# EAGLE design DualMotorCape-v7 (EAGLE 6.6.0)
DATABASE: H:\EXADLER\Libraries\Eagle\bom-ex.txt
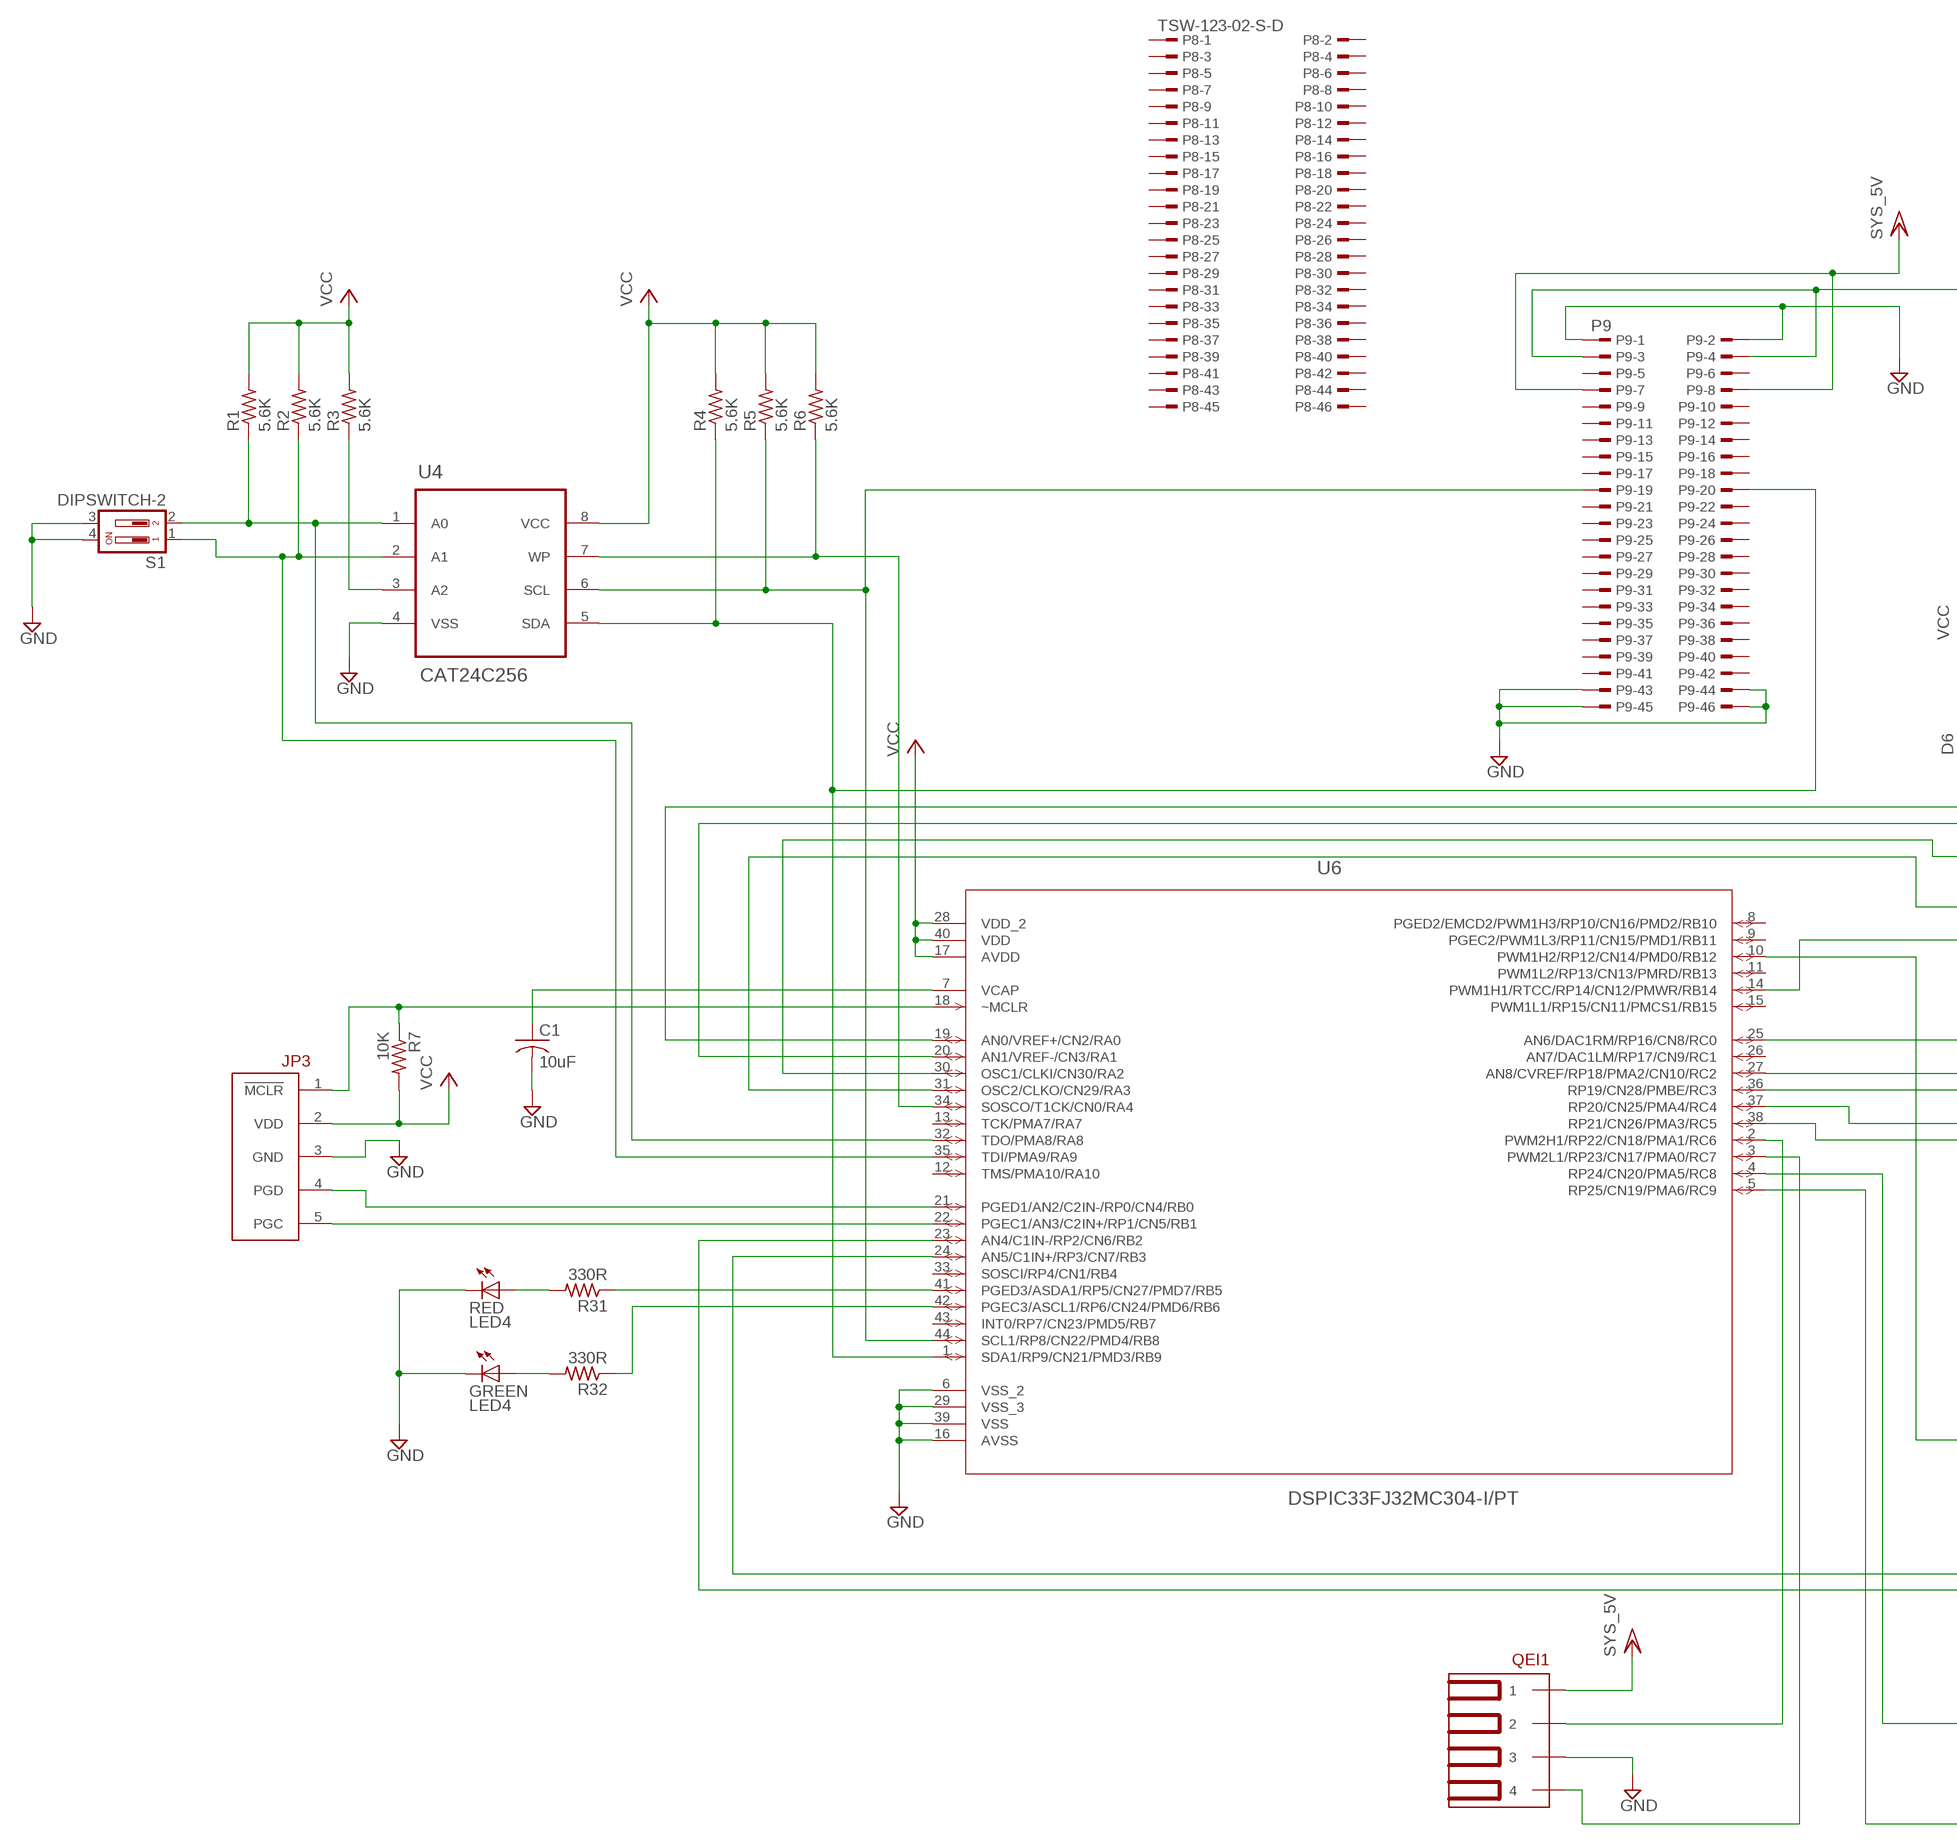
[diagram p0: schematic, sheet 1, part 1 of 2]
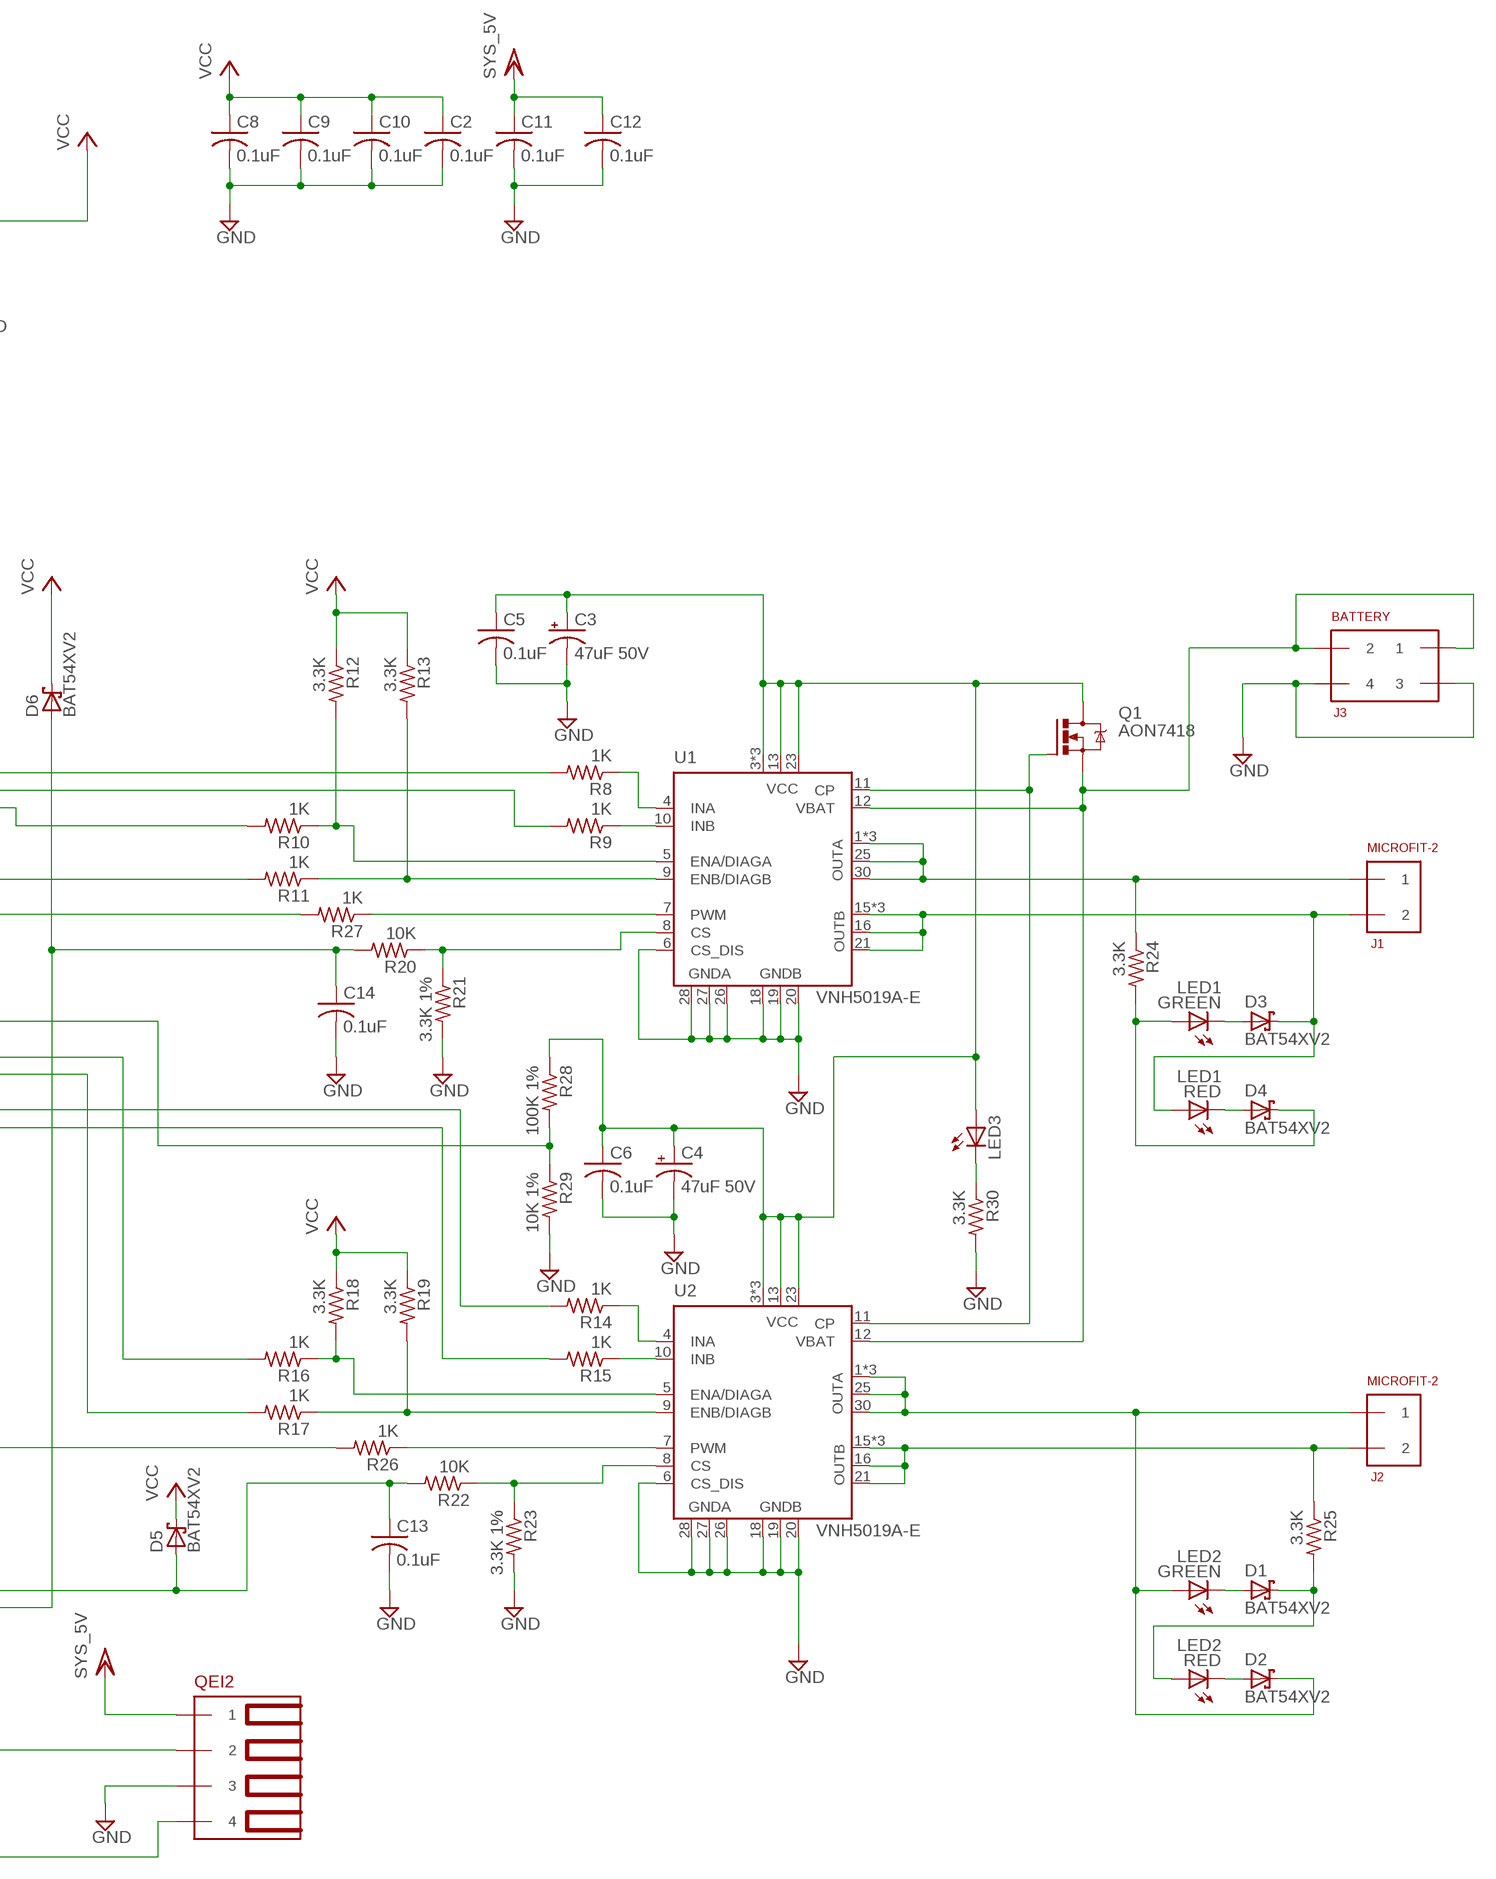
[diagram p1: schematic, sheet 1, part 2 of 2]

## Parts
C1  10uF  C-USC0805  [C0805]
C2  0.1uF  C-USC0603  [C0603]
C3  47uF 50V  CPOL-USUD-8X10  [UD-8X10_NICHICON]
C4  47uF 50V  CPOL-USUD-8X10  [UD-8X10_NICHICON]
C5  0.1uF  C-USC0603  [C0603]
C6  0.1uF  C-USC0603  [C0603]
C8  0.1uF  C-USC0603  [C0603]
C9  0.1uF  C-USC0603  [C0603]
C10  0.1uF  C-USC0603  [C0603]
C11  0.1uF  C-USC0603  [C0603]
C12  0.1uF  C-USC0603  [C0603]
C13  0.1uF  C-USC0603  [C0603]
C14  0.1uF  C-USC0603  [C0603]
D1  BAT54XV2  [SOD523]
D2  BAT54XV2  [SOD523]
D3  BAT54XV2  [SOD523]
D4  BAT54XV2  [SOD523]
D5  BAT54XV2  [SOD523]
D6  BAT54XV2  [SOD523]
J1  MICROFIT-2  [MICROFIT-2-R-TH]
J2  MICROFIT-2  [MICROFIT-2-R-TH]
J3  BATTERY  MICROFIT-4  [MICROFIT-4-R-TH]
JP3  ICD2/3-HEADER  [ICD2/3-HEADER]
LED1  KINGBRIGHT-BI-COLOR-LED  [LED-1.6X1.5MM-BI-COLOR]
LED2  KINGBRIGHT-BI-COLOR-LED  [LED-1.6X1.5MM-BI-COLOR]
LED3  LED-LNJP12X8ARA  [LED-603-PANASONIC]
LED4  KINGBRIGHT-BI-COLOR-LED  [LED-1.6X1.5MM-BI-COLOR]
P8  TSW-123-02-S-D  [TSW-123-02-S-D]
P9  P9  TSW-123-02-S-D  [TSW-123-02-S-D]
Q1  AON7418  MOSFET-N  [DFN3.3X3.3]
QEI1  MOLEX-KK-22-15-2046-4PIN  [MOLEX-KK-22-15-2046-4PIN]
QEI2  MOLEX-KK-22-15-2046-4PIN  [MOLEX-KK-22-15-2046-4PIN]
R1  5.6K  R-US_R0603  [R0603]
R2  5.6K  R-US_R0603  [R0603]
R3  5.6K  R-US_R0603  [R0603]
R4  5.6K  R-US_R0603  [R0603]
R5  5.6K  R-US_R0603  [R0603]
R6  5.6K  R-US_R0603  [R0603]
R7  10K  R-US_R0603  [R0603]
R8  1K  R-US_R0603  [R0603]
R9  1K  R-US_R0603  [R0603]
R10  1K  R-US_R0603  [R0603]
R11  1K  R-US_R0603  [R0603]
R12  3.3K  R-US_R0603  [R0603]
R13  3.3K  R-US_R0603  [R0603]
R14  1K  R-US_R0603  [R0603]
R15  1K  R-US_R0603  [R0603]
R16  1K  R-US_R0603  [R0603]
R17  1K  R-US_R0603  [R0603]
R18  3.3K  R-US_R0603  [R0603]
R19  3.3K  R-US_R0603  [R0603]
R20  10K  R-US_R0603  [R0603]
R21  3.3K 1%  R-US_R0603  [R0603]
R22  10K  R-US_R0603  [R0603]
R23  3.3K 1%  R-US_R0603  [R0603]
R24  3.3K  R-US_R0603  [R0603]
R25  3.3K  R-US_R0603  [R0603]
R26  1K  R-US_R0603  [R0603]
R27  1K  R-US_R0603  [R0603]
R28  100K 1%  R-US_R0603  [R0603]
R29  10K 1%  R-US_R0603  [R0603]
R30  3.3K  R-US_R0603  [R0603]
R31  330R  R-US_R0603  [R0603]
R32  330R  R-US_R0603  [R0603]
S1  DIPSWITCH-2  [DIPSWITCH-218-2]
U1  VNH5019A-E  [VNH5019A-E]
U2  VNH5019A-E  [VNH5019A-E]
U4  CAT24C256  [SOIC-8]
U6  DSPIC33FJ32MC304-I/PT  [QFP80P1200X1200X120-44N]

## Nets
GND: C1.2 C2.2 C3.- C4.- C5.2 C6.2 C8.2 C9.2 C10.2 C11.2 C12.2 C13.2 C14.2 J3.3 J3.4 JP3.3(GND) LED4.2 LED4.4 P9.1 P9.2 P9.43 P9.44 P9.45 P9.46 QEI1.P$3 QEI2.P$3 R21.2 R23.2 R29.2 R30.2 S1.3 S1.4 U1.6(CS_DIS) U1.18(GNDB) U1.19(GNDB) U1.20(GNDB) U1.26(GNDA) U1.27(GNDA) U1.28(GNDA) U2.6(CS_DIS) U2.18(GNDB) U2.19(GNDB) U2.20(GNDB) U2.26(GNDA) U2.27(GNDA) U2.28(GNDA) U4.4(VSS) U6.6(VSS_2) U6.16(AVSS) U6.29(VSS_3) U6.39(VSS)
M1+: J1.2 R24.1 U1.1(OUTA) U1.25(OUTA) U1.30(OUTA) U1.NC/OUTA(OUTA) U1.NC/OUTA@1(OUTA)
M1-: D3.C J1.1 LED1.1 U1.15(OUTB) U1.16(OUTB) U1.21(OUTB) U1.NC/OUTB(OUTB) U1.NC/OUTB@1(OUTB)
M2+: D2.C J2.2 LED2.3 U2.1(OUTA) U2.25(OUTA) U2.30(OUTA) U2.NC/OUTA(OUTA) U2.NC/OUTA@1(OUTA)
M2-: J2.1 R25.1 U2.15(OUTB) U2.16(OUTB) U2.21(OUTB) U2.NC/OUTB(OUTB) U2.NC/OUTB@1(OUTB)
N$1: D4.C LED1.3 R24.2
N$2: LED3.2(C) R30.1
N$3: LED4.1 R31.2
N$4: Q1.4(G) U1.11(CP) U2.11(CP)
N$5: LED4.3 R32.2
N$6: JP3.1(!MCLR) R7.1 U6.18(~MCLR)
N$8: R31.1 U6.41(PGED3/ASDA1/RP5/CN27/PMD7/RB5)
N$9: D3.A LED1.4
N$10: R3.1 U4.3(A2)
N$11: R6.1 U4.7(WP) U6.34(SOSCO/T1CK/CN0/RA4)
N$12: P9.19 R5.1 U4.6(SCL) U6.44(SCL1/RP8/CN22/PMD4/RB8)
N$13: P9.20 R4.1 U4.5(SDA) U6.1(SDA1/RP9/CN21/PMD3/RB9)
N$14: JP3.5(PGC) U6.22(PGEC1/AN3/C2IN+/RP1/CN5/RB1)
N$15: R32.1 U6.42(PGEC3/ASCL1/RP6/CN24/PMD6/RB6)
N$16: JP3.4(PGD) U6.21(PGED1/AN2/C2IN-/RP0/CN4/RB0)
N$18: R11.1 R13.2 U1.9(ENB/DIAGB)
N$19: R10.1 R12.2 U1.5(ENA/DIAGA)
N$20: R27.2 U6.14(PWM1H1/RTCC/RP14/CN12/PMWR/RB14)
N$21: R8.1 U1.4(INA)
N$22: R9.1 U1.10(INB)
N$23: R15.1 U2.10(INB)
N$24: R14.1 U2.4(INA)
N$27: R17.2 U6.36(RP19/CN28/PMBE/RC3)
N$28: R22.1 R23.1 U2.8(CS)
N$29: R20.1 R21.1 U1.8(CS)
N$32: R10.2 U6.30(OSC1/CLKI/CN30/RA2)
N$33: R11.2 U6.31(OSC2/CLKO/CN29/RA3)
N$35: R14.2 U6.37(RP20/CN25/PMA4/RC4)
N$36: R15.2 U6.38(RP21/CN26/PMA3/RC5)
N$37: R16.2 U6.27(AN8/CVREF/RP18/PMA2/CN10/RC2)
N$39: QEI1.P$2 U6.2(PWM2H1/RP22/CN18/PMA1/RC6)
N$40: QEI1.P$4 U6.3(PWM2L1/RP23/CN17/PMA0/RC7)
N$43: R26.1 U2.7(PWM)
N$44: R28.2 R29.1 U6.25(AN6/DAC1RM/RP16/CN8/RC0)
N$45: D1.A LED2.4
N$46: R27.1 U1.7(PWM)
N$47: C1.1 U6.7(VCAP)
N$49: C3.+ C4.+ C5.1 C6.1 LED3.1(A) Q1.5(D) Q1.6(D) Q1.7(D) Q1.8(D) Q1.9(D) R28.1 U1.3(VCC) U1.13(VCC) U1.23(VCC) U1.NC/VCC(VCC) U1.NC/VCC@1(VCC) U2.3(VCC) U2.13(VCC) U2.23(VCC) U2.NC/VCC(VCC) U2.NC/VCC@1(VCC)
N$50: D4.A LED1.2
N$52: D2.A LED2.2
N$53: D1.C LED2.1 R25.2
PWM1H2: R26.2 U6.10(PWM1H2/RP12/CN14/PMD0/RB12)
RA0: R8.2 U6.19(AN0/VREF+/CN2/RA0)
RA1: R9.2 U6.20(AN1/VREF-/CN3/RA1)
RB2: C14.1 D6.A R20.2 U6.23(AN4/C1IN-/RP2/CN6/RB2)
RB3: C13.1 D5.A R22.2 U6.24(AN5/C1IN+/RP3/CN7/RB3)
RB6: QEI2.P$2 U6.4(RP24/CN20/PMA5/RC8)
RB7: QEI2.P$4 U6.5(RP25/CN19/PMA6/RC9)
RC8: R1.1 S1.2 U4.1(A0) U6.32(TDO/PMA8/RA8)
RC9: R2.1 S1.1 U4.2(A1) U6.35(TDI/PMA9/RA9)
U2ENA: R16.1 R18.2 U2.5(ENA/DIAGA)
U2ENB: R17.1 R19.2 U2.9(ENB/DIAGB)
VBAT: J3.1 J3.2 Q1.1(S) Q1.2(S) Q1.3(S) U1.12(VBAT) U2.12(VBAT)
VCC: C2.1 C8.1 C9.1 C10.1 D5.C D6.C JP3.2(VDD) P9.3 P9.4 R1.2 R2.2 R3.2 R4.2 R5.2 R6.2 R7.2 R12.1 R13.1 R18.1 R19.1 U4.8(VCC) U6.17(AVDD) U6.28(VDD_2) U6.40(VDD)
VCC/2: C11.1 C12.1 P9.7 P9.8 QEI1.P$1 QEI2.P$1 ; supply symbol labelled SYS_5V
Unconnected: P8.1 P8.2 P8.3 P8.4 P8.5 P8.6 P8.7 P8.8 P8.9 P8.10 P8.11 P8.12 P8.13 P8.14 P8.15 P8.16 P8.17 P8.18 P8.19 P8.20 P8.21 P8.22 P8.23 P8.24 P8.25 P8.26 P8.27 P8.28 P8.29 P8.30 P8.31 P8.32 P8.33 P8.34 P8.35 P8.36 P8.37 P8.38 P8.39 P8.40 P8.41 P8.42 P8.43 P8.44 P8.45 P8.46 P9.5 P9.6 P9.9 P9.10 P9.11 P9.12 P9.13 P9.14 P9.15 P9.16 P9.17 P9.18 P9.21 P9.22 P9.23 P9.24 P9.25 P9.26 P9.27 P9.28 P9.29 P9.30 P9.31 P9.32 P9.33 P9.34 P9.35 P9.36 P9.37 P9.38 P9.39 P9.40 P9.41 P9.42 U6.8(PGED2/EMCD2/PWM1H3/RP10/CN16/PMD2/RB10) U6.9(PGEC2/PWM1L3/RP11/CN15/PMD1/RB11) U6.11(PWM1L2/RP13/CN13/PMRD/RB13) U6.12(TMS/PMA10/RA10) U6.13(TCK/PMA7/RA7) U6.15(PWM1L1/RP15/CN11/PMCS1/RB15) U6.26(AN7/DAC1LM/RP17/CN9/RC1) U6.33(SOSCI/RP4/CN1/RB4) U6.43(INT0/RP7/CN23/PMD5/RB7)

## Library data of the parts
C1 = rcl:C-US: CAPACITOR, American symbol; MPN: 08056C106KAT2A; OC_NEWARK: 60M3276
C2 C5 C6 C8-C14 = rcl:C-US: CAPACITOR, American symbol; MPN: 06035C104KAT2A; OC_NEWARK: 54K2412
C3 C4 = rcl:CPOL-US: POLARIZED CAPACITOR, American symbol; DIGIKEY: 493-2303-1-ND; MPN: EEE-FK1H470XP; OC_NEWARK: 23T0862
D1-D6 = MyCustom:BAT54XV2: Schottky Diodes Source: Fairchild .. BAT54.pdf; DIGIKEY#: BAT54XV2CT-ND; MPN: BAT54XV2; OC_NEWARK: 84W8959
J1 J2 = MyCustom:MICROFIT-2; OC_NEWARK: unknown
J3 = MyCustom:MICROFIT-4; OC_NEWARK: unknown
JP3 = MyCustom:ICD2/3-HEADER; OC_NEWARK: unknown
LED1 LED2 LED4 = MyCustom:KINGBRIGHT-BI-COLOR-LED: BI-COLOR SMD CHIP LED 1.6x1.5mm http://www.us.kingbright.com/images/catalog/SPEC/APTB1615ESGC-F01.pdf; OC_NEWARK: unknown
LED3 = MyCustom:LED-LNJP12X8ARA; OC_NEWARK: unknown
P8 P9 = con-samtec:TSW-123-02-S-D: THROUGH-HOLE .025" SQ POST HEADER Source: Samtec TSW.pdf; OC_FARNELL: unknown; OC_NEWARK: unknown
Q1 = MyCustom:MOSFET-N: MOSFET N-Channel http://www.aosmd.com/res/data_sheets/AON7418.pdf http://www.aosmd.com/res/packaging_information/DFN3.3x3.3.pdf; OC_NEWARK: unknown
QEI1 QEI2 = MyCustom:MOLEX-KK-22-15-2046-4PIN
R1-R6 = rcl:R-US_: RESISTOR, American symbol; MF: FARNELL; MPN: MC 0.063W 0603 1% 5K6; OC_NEWARK: 39K0039
R7-R11 R14-R17 R20 R22 R26 R27 R31 R32 = rcl:R-US_: RESISTOR, American symbol; OC_NEWARK: unknown
R12 R13 R18 R19 R21 R23-R25 R30 = rcl:R-US_: RESISTOR, American symbol; MF: VISHAY/DALE; MPN: CRCW06033K30FKEA; OC_NEWARK: 52K8377
R28 = rcl:R-US_: RESISTOR, American symbol; MPN: ASC0603-100KFT5; OC_NEWARK: 83T6582
R29 = rcl:R-US_: RESISTOR, American symbol; MF: VISHAY/DALE; MPN: CRCW060310K0FKTA; OC_NEWARK: 66F9086
S1 = MyCustom:DIPSWITCH-2; DIGIKEY#: CT2182LPST-ND; OC_NEWARK: unknown
U1 U2 = MyCustom:VNH5019A-E; MPN: VNH5019A-E; OC_NEWARK: 73T2614
U4 = MyCustom:CAT24C256: ON Semi CAT24C256 CMOS Serial EEPROM http://www.onsemi.com/pub_link/Collateral/CAT24C256-D.PDF; MPN: CAT24C256WI-G; OC_NEWARK: 06R0552
U6 = MyCustom:DSPIC33FJ32MC304-I/PT: 16-bit Digital Signal Controllers; DESCRIPTION: 16-bit Digital Signal Controllers; MPN: DSPIC33FJ32MC304-I/PT; OC_FARNELL: 1576821; OC_NEWARK: 39M8208; PACKAGE: TQFP-44; SUPPLIER: Microchip

## Board
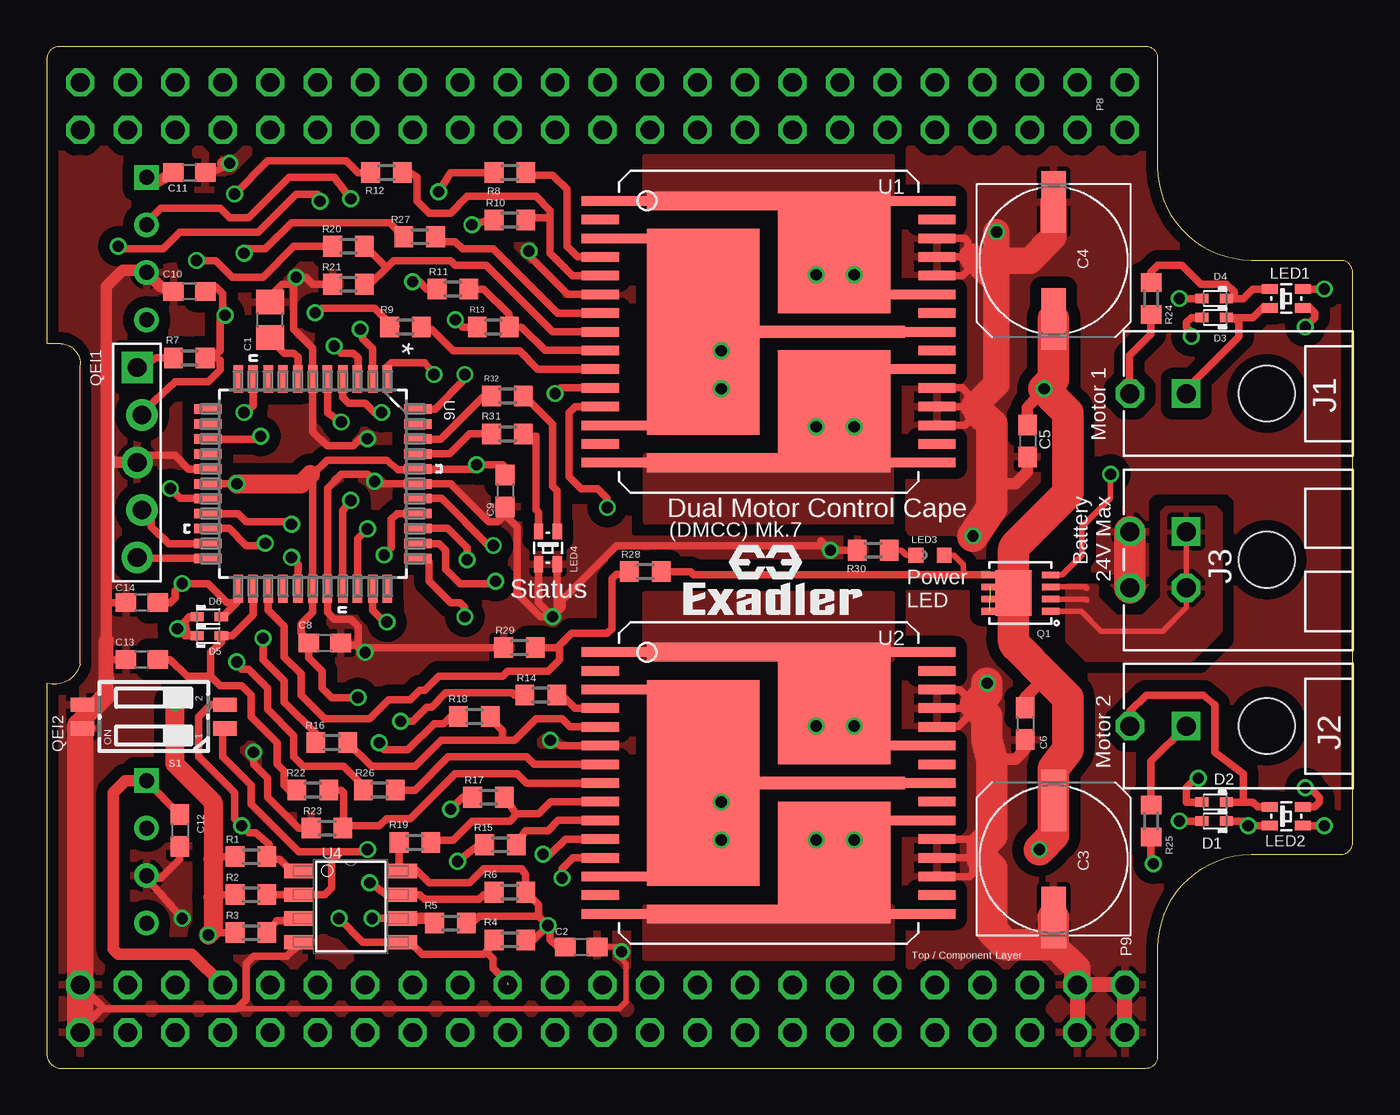
[diagram p2: board, top side]
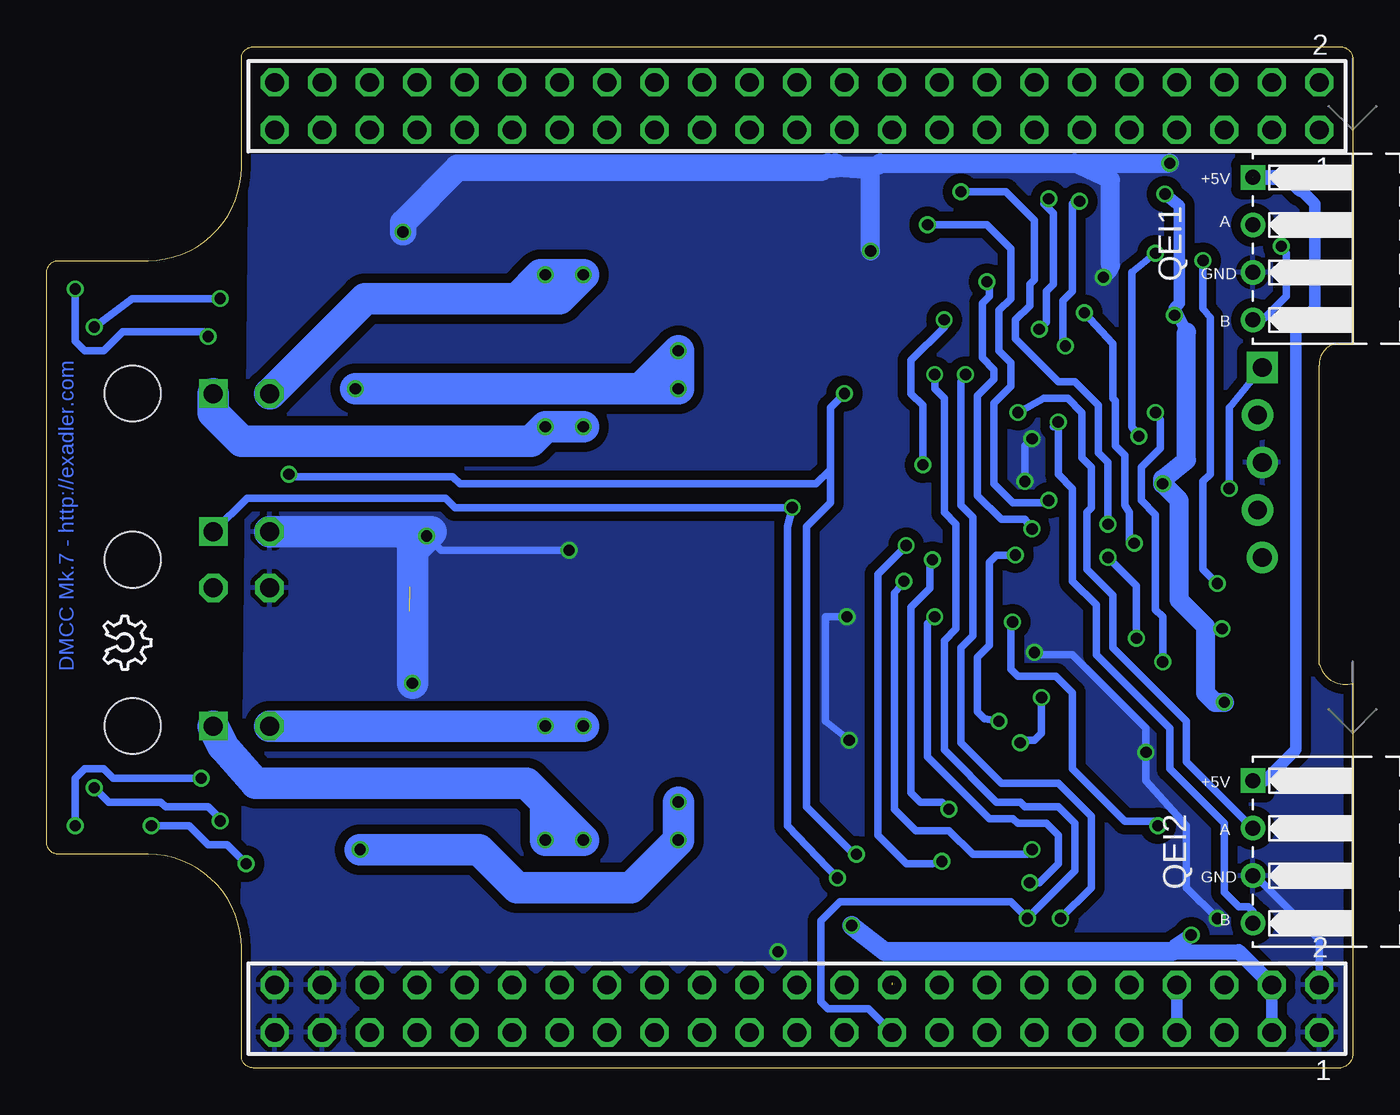
[diagram p3: board, bottom side, seen from below]

Size 69.86 x 54.61 mm. Coordinates in mm from the lower left corner, seen from the top.
Outline: 0.01,20.57 0.01,0.89 arc90 0.65,0 58.81,0 arc90 59.45,0.64 59.45,6.43 arc-90 64.45,11.43 69.23,11.43 arc90 69.86,12.06 69.86,42.55 arc90 69.23,43.18 64.45,43.18 arc-90 59.45,48.18 59.45,53.98 arc90 58.81,54.61 0.65,54.61 arc90 0.01,53.98 0.01,38.73 0.77,38.73 arc-90 1.79,37.59 1.79,21.59 arc-90 0.01,20.57
Copper layers (1*16): Top 0.035mm / dielectric 1.5mm / Bottom 0.035mm
Design rules "dirt_cheap_dirty_boards.v1": minimum track width 5mil, minimum drill 12mil, track to track 5mil, track to pad 5mil, pad to pad 5mil, via to via 5mil, smd to smd 0mil, copper to edge 10mil, drill to drill 10mil, minimum pad ring 10mil, minimum via ring 6mil, stop-mask expansion 2mil, vias tented up to drill 25mil, thermal gap 10mil

### Footprints (pad centres in the part's own frame; a part is rotated, then mirrored left to right if it is on the bottom)
C0805 = smd 1.3 x 1.5: 1 -0.95,0; 2 0.95,0
C0603 = smd 1.1 x 1: 1 -0.85,0; 2 0.85,0
UD-8X10_NICHICON = smd 3.3 x 1.3: + 3.125,0; - -3.125,0
SOD523 = smd 0.7 x 0.5: A 0.7,0; C -0.6,0
MICROFIT-2-R-TH = drill 1.016 square: 1 0,8.915 | drill 1.016 octagon: 2 0,11.913 | hole 2.997: 0,4.597
MICROFIT-4-R-TH = drill 1.016 square: 1 1.499,8.915 | drill 1.016 octagon: 2 -1.499,8.915; 3 1.499,11.913; 4 -1.499,11.913 | hole 2.997: 0,4.597
ICD2/3-HEADER = drill 1 pad 1.676 square: 1 0,6.35 | drill 1 pad 1.676: 2 0.254,3.81; 3 0,1.27; 4 0.254,-1.27; 5 0,-3.81
LED-1.6X1.5MM-BI-COLOR = smd 0.85 x 0.5: 1 0.875,0.5; 2 -0.875,0.5; 3 0.875,-0.5; 4 -0.875,-0.5
LED-603-PANASONIC = smd 0.8 x 0.8: 1 0,0.75; 2 0,-0.75
TSW-123-02-S-D = drill 1 pad 1.5 octagon: 1 27.94,-1.27; 2 27.94,1.27; 3 25.4,-1.27; 4 25.4,1.27; 5 22.86,-1.27; 6 22.86,1.27; 7 20.32,-1.27; 8 20.32,1.27; 9 17.78,-1.27; 10 17.78,1.27; 11 15.24,-1.27; 12 15.24,1.27; 13 12.7,-1.27; 14 12.7,1.27; 15 10.16,-1.27; 16 10.16,1.27; 17 7.62,-1.27; 18 7.62,1.27; 19 5.08,-1.27; 20 5.08,1.27; 21 2.54,-1.27; 22 2.54,1.27; 23 0,-1.27; 24 0,1.27; 25 -2.54,-1.27; 26 -2.54,1.27; 27 -5.08,-1.27; 28 -5.08,1.27; 29 -7.62,-1.27; 30 -7.62,1.27; 31 -10.16,-1.27; 32 -10.16,1.27; 33 -12.7,-1.27; 34 -12.7,1.27; 35 -15.24,-1.27; 36 -15.24,1.27; 37 -17.78,-1.27; 38 -17.78,1.27; 39 -20.32,-1.27; 40 -20.32,1.27; 41 -22.86,-1.27; 42 -22.86,1.27; 43 -25.4,-1.27; 44 -25.4,1.27; 45 -27.94,-1.27; 46 -27.94,1.27
DFN3.3X3.3 = smd 0.95 x 0.35: 1 -1.62,0.975; 2 -1.62,0.325; 3 -1.62,-0.325; 4 -1.62,-0.975; 5 1.62,-0.975; 6 1.62,-0.325; 7 1.62,0.325; 8 1.62,0.975 | smd 1.93 x 2.45: 9 0.381,0
MOLEX-KK-22-15-2046-4PIN = drill 0.8 square: P$1 -3.81,-0.254 | drill 0.8: P$2 -1.27,-0.254; P$3 1.27,-0.254; P$4 3.81,-0.254
R0603 = smd 1 x 1.1: 1 -0.85,0; 2 0.85,0
DIPSWITCH-218-2 = smd 0.76 x 1.27: 1 -0.635,-3.81; 2 0.635,-3.81; 3 0.635,3.81; 4 -0.635,3.81
VNH5019A-E = smd 0.508 x 12: 1 -7,-4; 15 7,-4; 16 7,4; 30 -7,4 | smd 0.508 x 2: 2 -6,-9; 4 -4,-9; 5 -3,-9; 6 -2,-9; 7 -1,-9; 8 0,-9; 9 1,-9; 10 2,-9; 11 3,-9; 12 4,-9; 14 6,-9; 17 6,9; 18 5,9; 19 4,9; 20 3,9; 22 1,9; 24 -1,9; 26 -3,9; 27 -4,9; 28 -5,9; 29 -6,9 | smd 0.508 x 4: 3 -5,-8; 13 5,-8; 21 2,8; 23 0,8; 25 -2,8 | smd 6.5 x 6: NC/OUTA -4.25,3.5; NC/OUTB 4.25,3.5 | smd 1 x 7.5: NC/OUTA@1 -7,-2.755; NC/OUTB@1 7,-2.755 | smd 11 x 6: NC/VCC 0,-3.5 | smd 0.65 x 8.3: NC/VCC@1 0,3.145
SOIC-8 = smd 1.524 x 0.762: 1 -2.794,1.905; 2 -2.794,0.635; 3 -2.794,-0.635; 4 -2.794,-1.905; 5 2.794,-1.905; 6 2.794,-0.635; 7 2.794,0.635; 8 2.794,1.905
QFP80P1200X1200X120-44N = smd 1.473 x 0.508: 1 -5.613,3.988; 2 -5.613,3.2; 3 -5.613,2.388; 4 -5.613,1.6; 5 -5.613,0.787; 6 -5.613,0; 7 -5.613,-0.787; 8 -5.613,-1.6; 9 -5.613,-2.388; 10 -5.613,-3.2; 11 -5.613,-3.988; 23 5.613,-3.988; 24 5.613,-3.2; 25 5.613,-2.388; 26 5.613,-1.6; 27 5.613,-0.787; 28 5.613,0; 29 5.613,0.787; 30 5.613,1.6; 31 5.613,2.388; 32 5.613,3.2; 33 5.613,3.988 | smd 0.508 x 1.473: 12 -3.988,-5.613; 13 -3.2,-5.613; 14 -2.388,-5.613; 15 -1.6,-5.613; 16 -0.787,-5.613; 17 0,-5.613; 18 0.787,-5.613; 19 1.6,-5.613; 20 2.388,-5.613; 21 3.2,-5.613; 22 3.988,-5.613; 34 3.988,5.613; 35 3.2,5.613; 36 2.388,5.613; 37 1.6,5.613; 38 0.787,5.613; 39 0,5.613; 40 -0.787,5.613; 41 -1.6,5.613; 42 -2.388,5.613; 43 -3.2,5.613; 44 -3.988,5.613

### Placement (x,y rotation side)
C1  11.95,40.01 90 top
C2  28.59,6.48 0 top
C3  53.86,11.18 90 top
C4  53.86,43.18 270 top
C5  52.46,33.53 270 top
C6  52.33,18.41 270 top
C8  14.87,22.73 0 top
C9  24.52,30.86 270 top
C10  7.63,41.53 180 top
C11  7.63,47.88 0 top
C12  7.12,12.7 270 top
C13  5.09,21.84 180 top
C14  5.09,24.89 180 top
D1  62.49,13.21 180 top
D2  62.49,14.22 180 top
D3  62.49,40.13 180 top
D4  62.49,41.15 180 top
D5  8.65,23.11 0 top
D6  8.65,24.13 0 top
J1  69.86,36.07 90 top
J2  69.86,18.29 90 top
J3  69.86,27.18 90 top
JP3  4.84,31.11 0 top
LED1  66.3,41.15 180 top
LED2  66.3,13.46 180 top
LED3  47.25,27.43 270 top
LED4  26.81,27.81 90 top
P8  29.73,51.44 0 bottom
P9  29.73,3.17 0 bottom
Q1  52.08,25.4 180 top
QEI1  5.09,43.81 270 bottom
QEI2  5.09,11.56 270 bottom
R1  10.93,11.3 180 top
R2  10.93,9.27 180 top
R3  10.93,7.24 180 top
R4  24.78,6.86 0 top
R5  21.6,7.75 0 top
R6  24.78,9.4 0 top
R7  7.63,37.97 0 top
R8  24.78,47.88 180 top
R9  19.19,39.62 180 top
R10  24.78,45.34 180 top
R11  21.73,41.66 180 top
R12  18.17,47.88 0 top
R13  23.89,39.62 0 top
R14  26.43,19.94 180 top
R15  24.27,11.94 180 top
R16  15.25,17.4 180 top
R17  23.63,14.48 180 top
R18  22.87,18.8 0 top
R19  19.7,12.06 0 top
R20  16.14,43.94 180 top
R21  16.14,41.91 180 top
R22  14.23,14.86 180 top
R23  15,12.83 180 top
R24  59.07,41.15 90 top
R25  59.07,13.21 270 top
R26  17.79,14.86 180 top
R27  19.95,44.45 180 top
R28  32.01,26.54 180 top
R29  25.28,22.48 180 top
R30  44.21,27.69 180 top
R31  24.65,33.91 0 top
R32  24.65,35.94 0 top
S1  5.73,18.8 90 top
U1  38.62,39.37 270 top
U2  38.62,15.24 270 top
U4  16.27,8.64 0 top
U6  14.23,31.24 270 top
U$1  [EXADLER-LOGO]  33.16,24 0 top
U$2  [OSHW_6X100_NOTEXT]  66.81,21.34 90 top

### Tracks (layer width: path | path; a pad name or v marks a point on that pad's centre or on a via)
GND  (via drill 0.6)
  Top 0.305: v30.74,6.22 30.49,6.48 C2.2 30.36,6.48 30.74,6.1 30.74,5.84 31,5.59 31,3.56 30.62,3.17 10.17,3.17
  Top 0.406: U1.28 49.11,44.37 49.29,44.2 49.29,43.37 | U1.26 48.98,42.37 49.73,43.12 | U1.18 49.11,34.37 49.29,34.54 49.41,34.54 49.92,35.05 | U1.20 48.98,36.37 49.29,36.07 49.29,35.37 | U1.27 49.29,43.37 | 49.29,43.37 49.48,43.37 | U1.19 49.29,35.37 | 49.29,35.37 49.6,35.37 | U2.20 49.24,12.24 49.79,11.68 49.48,11.37 49.48,11.24 | U2.19 49.48,11.24 | 49.48,11.24 49.54,11.18 49.54,10.41 49.37,10.24 U2.18 | U2.28 48.86,20.24 49.67,19.43 49.79,19.3 49.73,19.24 | U2.27 49.73,19.24 | U2.26 48.73,18.24 49.73,19.24 | U2.6 27.47,17.24 v26.93,17.53 | P9.1 1.79,2.03 2.93,3.17 | 2.93,3.17 10.17,3.17 10.68,3.68 10.68,5.59 11.06,5.97 12.84,5.97 13.47,6.6 13.47,6.86 14.11,6.86 U4.4 | 2.93,3.17 2.93,3.3 P9.2 | 1.93,9.54 1.79,9.4 | 1.92,15.37 1.79,15.24 | 1.92,16.64 1.79,16.51 | JP3.3 5.22,32.77 6.87,32.77 7.61,32.03 U6.16 | v17.16,33.66 16.77,33.66 16.39,33.27 15,33.27 14.23,34.04 U6.6 14.23,38.48 13.22,39.5 13.22,42.16 v13.35,42.29 | R30.2 v41.92,27.69 41.54,28.07 | 2.3,19.05 2.04,18.54 2.42,18.16 S1.4 | v9.79,48.39 9.66,48.26 8.77,47.88 C11.2 | C14.2 3.19,24.89 | S1.3 2.68,19.43 | C13.2 3.19,21.84 | R21.2 14.23,41.91 13.85,42.29 v13.35,42.29 | 41.41,28.19 41.54,28.07 | v7.25,8 5.34,10.16 QEI2.P$3 5.47,10.16 6.11,10.16 7.12,11.18 C12.2 | 41.54,28.07 41.41,27.94 30.49,27.94 27.57,25.02 27.57,24.64 v27.06,24.13 | v11.06,16.89 11.06,16.26 11.82,15.49 11.82,14.48 13.47,12.83 R23.2 | U1.6 27.86,41.37 25.66,43.56 v25.79,43.69 | C1.2 11.95,41.27 12.58,41.91 12.96,41.91 v13.35,42.29 | C9.2 24.31,30.01 24.31,29.81 25.16,28.96 25.16,25.4 26.43,24.13 v27.06,24.13 | 24.65,29.97 24.65,29.72 24.14,29.21 23.63,29.21 21.6,31.24 U6.39 17.79,31.24 v17.54,31.37 17.16,31.75 15.76,31.75 15.02,31.01 U6.29 15.02,24.36 15.38,24 16.27,24 16.65,23.62 16.65,22.61
  Top 0.406: C8.2 15.85,22.61 16.65,22.61 | 16.65,22.61 16.65,22.48 v17.03,22.23 17.28,22.48 R29.2 | LED4.4 27.31,24.38 v27.06,24.13 | LED4.2 26.31,24.88 v27.06,24.13
  Top 0.61: 3.19,21.34 3.19,21.84 | 3.19,22.86 3.19,24.89 3.19,32.51 | 3.19,32.51 3.19,41.78 4.07,42.67 5.22,42.67 QEI1.P$3 6.11,41.78 C10.2 | JP3.3 3.31,32.38 3.19,32.51 | C6.2 52.33,17.02 51.83,16.51 50.56,16.51 | C5.2 52.46,31.88 51.83,31.24 51.06,31.24 50.56,30.73 | 3.31,20.83 3.19,19.94 | v9.79,48.39 9.41,48.39
  Top 0.813: P9.43 P9.44 P9.46 P9.45 | 3.19,19.94 3.19,21.84 3.19,22.86
  Top 1.016: 1.79,18.29 1.79,18.54 2.3,19.05 2.68,19.43 3.19,19.94
  Top 1.422: 49.92,35.05 49.6,35.37 50.81,36.58 50.81,42.04 | 50.81,42.04 49.73,43.12 49.67,43.18 | 49.67,43.18 49.48,43.37 | v50.81,44.7 50.81,42.04 | 53.86,6.6 55.13,5.33 P9.44 | C4.- 53.86,44.45 52.59,43.18 49.67,43.18 | P9.1 P9.2 1.79,9.4 1.79,15.24 1.79,16.51 | 1.79,18.29 1.79,16.76
  Top 1.676: C3.- 53.86,6.6 51.32,6.6 50.56,7.37 50.56,10.67 50.05,11.18 50.05,11.94 50.56,12.45 50.56,16.51 50.3,17.53 50.3,18.8 49.79,19.3 | 49.92,35.05 50.56,34.42 50.56,30.73 50.56,29.97 v49.54,28.45 | J3.4 J3.3 | v50.3,20.57 50.3,20.07 49.67,19.43
  Bottom 0.406: 28.46,48.13 28.2,48.13 28.08,48.26 | v26.93,17.53 28.2,18.54 28.2,24.13 v27.06,24.13 | v17.54,31.37 17.54,33.27 v17.16,33.66 | v41.92,27.69 48.78,27.69 v49.54,28.45 | QEI2.P$3 5.22,10.29 1.79,6.86 P9.2 | v7.25,8 8.9,9.65 8.9,12.95 11.06,15.37 v11.06,16.89 11.06,18.16 15,22.1 16.9,22.1 v17.03,22.23 | 12.96,42.93 12.96,42.67
  Bottom 0.61: 25.79,48.01 25.41,48.26
  Bottom 0.813: 12.96,42.67 v13.35,42.29
  Bottom 1.016: v25.79,43.69 25.79,48.01 27.57,48.13 27.7,48.26 25.41,48.26 25.28,48.39 14.87,48.39 | 14.87,48.39 v9.79,48.39 | 14.87,48.39 12.96,47.5 12.96,42.93
  Bottom 1.27: 28.08,48.26 27.7,48.26
  Bottom 1.422: 28.46,48.13 47.89,48.13 50.81,45.21 v50.81,44.7
  Bottom 1.676: J3.3 49.31,28.68 v49.54,28.45 50.3,27.69 v50.3,20.57
  pour Top (isolate 0.61, rank 2): 69.61,42.93 57.67,42.93 57.67,11.68 69.61,11.68
  pour Bottom (isolate 0.508, rank 2): 0.52,48.77 0.52,0.76 59.45,0.76 58.94,48.77
  pour Top (isolate 0.61, rank 2): 0.01,54.1 0.26,-0.25 70.37,0 70.11,53.85 0.26,53.59
M1+  (via drill 0.6)
  Top 0.305: U1.25 42.94,41.4 43.19,42.67
  Top 0.406: R24.1 59.07,39.24 57.92,38.1 57.92,36.09 J1.2
  Top 1.676: v43.19,42.42 43.19,42.67 43.19,43.43 | U1.NC/OUTA 42.11,43.62 v41.16,42.42
  Bottom 1.676: J1.2 57.92,36.07 52.84,41.15 42.43,41.15 v41.16,42.42 42.94,42.42 44.21,41.15 44.71,41.15 43.44,42.42 v43.19,42.42
  pour Top: 32.01,46.23 32.01,48.77 45.22,48.77 45.22,46.23
M1-  (via drill 0.6)
  Top 0.305: U1.21 44.37,37.37 U1.NC/OUTB
  Top 0.406: LED1.1 65.04,40.65 64.53,40.13 63.51,40.13 | 63.51,40.13 D3.C | 63.51,40.13 63.76,39.88 63.76,39.12 60.95,36.3 J1.1
  Top 1.676: U1.NC/OUTB 41.99,35.12 v41.16,34.29
  Bottom 1.676: J1.1 60.95,35.03 59.45,33.53 43.95,33.53 v43.19,34.29 v41.16,34.29
  pour Top: 32.01,32.77 32.01,29.21 45.22,29.21 45.22,32.51
M2+  (via drill 0.6)
  Top 0.305: U2.25 43.19,17.27 v43.19,18.29 | 43.19,19.81 U2.30 U2.1
  Top 0.406: LED2.3 64.79,13.96 64.53,14.22 64.02,14.22 | D2.C 64.02,14.22 | J2.2 57.95,19.07 58.81,19.94 61.86,19.94 62.49,19.43 62.49,16.89 64.02,15.75 64.02,14.22
  Top 1.676: v43.19,18.29 43.19,19.81 | v41.16,18.29 41.16,18.53 U2.NC/OUTA
  Bottom 1.676: J2.2 v41.16,18.29
  pour Top (isolate 0.406): 32.01,21.84 32.01,25.4 45.22,25.4 45.22,21.84
M2-  (via drill 0.6)
  Top 0.305: U2.16 43.14,11.61 | 43.14,11.61 43.19,11.94 | 43.14,11.61 43.19,12.95 43.19,13.21 43.22,13.24 U2.21
  Top 0.406: R25.1 59.07,16.41 J2.1
  Top 1.676: v43.19,12.19 43.19,11.94 | v41.16,12.19 41.04,12.19 U2.NC/OUTB
  Bottom 1.676: J2.1 60.44,17.25 58.68,15.24 44.21,15.24 v41.16,12.19 v43.19,12.19 43.19,13.97
  pour Top (isolate 0.305): 32.01,8.64 45.22,8.64 45.22,5.84 32.01,5.84
N$1
  Top 0.406: LED1.3 65.3,41.65 65.29,41.66 64.53,41.66 64.02,41.15 63.51,41.15 | R24.2 59.07,42.55 59.45,42.93 60.72,42.93 61.73,41.91 63.11,41.91 63.52,41.5 63.52,41.16 63.51,41.15 | 63.51,41.15 D4.C
N$2
  Top 0.305: R30.1 45.73,27.69 45.98,27.43 LED3.2
N$3
  Top 0.406: 25.5,33.82 R31.2 25.63,33.78 26.17,33.78 26.17,29.84 26.3,29.72 LED4.1
N$4  (via drill 0.6)
  Top 0.305: Q1.4 54.33,26.38 55.38,27.43 55.38,28.96 56.91,30.48 v56.91,31.75
  Top 0.406: U1.11 27.49,36.37 v27.19,36.07 | U2.11 27.74,12.24 26.93,11.43 v26.55,11.43
  Bottom 0.406: v56.91,31.75 56.78,31.62 48.14,31.62 47.76,31.24 28.71,31.24 27.95,32 | 27.95,32 27.95,30.23 29.22,28.96 29.22,13.97 26.68,11.43 v26.55,11.43 | 27.95,32 27.95,35.31 v27.19,36.07
N$5
  Top 0.406: R32.2 25.54,35.94 27.06,34.42 27.06,31.11 27.31,30.87 LED4.3
N$6  (via drill 0.6)
  Top 0.406: U6.18 7.15,30.45 v6.61,30.99 | JP3.1 5.22,37.47 5.85,37.97 R7.1
  Bottom 0.406: v6.61,30.99 6.61,35.31 JP3.1
N$8
  Top 0.406: U6.41 21.55,32.84 22.62,33.91 R31.1
N$9  (via drill 0.6)
  Top 0.406: LED1.4 68.33,41.65 v68.34,41.66 | v61.22,39.12 61.22,39.37 60.97,39.62 60.97,39.88 61.22,40.13 D3.A
  Bottom 0.406: v68.34,41.66 68.34,38.86 67.83,38.35 66.81,38.35 65.8,39.37 61.48,39.37 v61.22,39.12
N$10
  Top 0.406: 13.73,7.87 U4.3 12.84,8 12.71,7.87 12.29,7.87 R3.1
N$11  (via drill 0.6)
  Top 0.406: U6.34 19.92,27.18 20.33,27.18 20.46,27.05 20.46,26.04 21.6,24.89 22.11,24.89 22.36,24.64 v22.36,24.13 | v17.28,9.91 18.17,9.27 U4.7 19.95,9.27 20.2,9.02 23.12,9.02 23.38,9.27 23.8,9.27 R6.1
  Bottom 0.406: v17.28,9.91 16.77,9.91 15.76,10.92 15.76,12.45 16.39,13.08 17.92,13.08 18.17,13.34 19.44,13.34 22.74,16.64 22.74,23.75 v22.36,24.13
N$12  (via drill 0.6)
  Top 0.406: U4.6 v17.41,8 | U6.44 20.76,35.23 22.36,36.83 v22.36,37.08
  Top 0.61: U4.6 20.88,8 R5.1
  Bottom 0.406: P9.19 25.92,3.17 28.08,3.17 28.46,3.56 28.46,7.87 27.44,8.89 18.3,8.89 v17.41,8 | 17.66,8 v17.41,8 | v17.41,8 14.87,10.54 14.87,13.08 15.76,13.97 17.54,13.97 17.79,14.22 19.06,14.22 21.85,17.02 21.85,22.86 21.22,23.5 21.22,29.08 21.85,29.72 21.85,35.81 22.36,36.32 v22.36,37.08
N$13  (via drill 0.6)  (1 unrouted)
  Top 0.406: U6.1 18.22,37.52 18.43,37.72 20.2,37.72 v20.71,37.08 | v15.63,8 16.9,6.73 U4.5 19.44,6.73 20.08,6.1 23.38,6.1 23.51,6.22 | 24.65,4.57 23.89,5.33 23.89,5.84 23.51,6.22 | R4.1 23.93,6.64 23.51,6.22
  Top 0.61: R4.1 24.14,6.86
  Bottom 0.406: v20.71,37.08 20.97,36.7 20.97,30.1 20.33,29.46 20.33,23.11 20.97,22.48 20.97,17.4 18.81,15.24 15.76,15.24 13.98,13.46 13.98,9.65 v15.63,8 15.76,7.87
N$14
  Top 0.406: U6.22 4.89,27.25 JP3.5
N$15
  Top 0.406: U6.42 21.07,33.63 23.29,35.85 R32.1
N$16
  Top 0.406: JP3.4 5.6,29.34 5.6,28.96 6.51,28.04 U6.21
N$18
  Top 0.406: U1.9 26.66,38.37 25.41,39.62 R13.2 24.74,40.3 23.38,41.66 R11.1
N$19
  Top 0.406: U1.5 28.13,42.37 26.93,43.56 26.93,45.47 | R12.2 19.44,47.88 19.82,47.62 19.82,46.35 20.46,45.72 21.6,45.72 22.49,46.61 26.17,46.61 26.93,45.85 26.93,45.47 | R10.1 25.75,45.47 26.93,45.47
N$20  (via drill 0.6)
  Top 0.406: U6.14 11.29,33.63 v11.44,33.78 | v10.55,43.56 10.81,43.81 11.69,43.81 13.09,45.21 18.34,45.21 R27.2
  Bottom 0.406: v10.55,43.56 11.82,42.55 11.82,34.29 v11.44,33.78
N$21
  Top 0.406: U1.4 28.4,43.37 27.82,43.94 27.82,46.99 27.06,47.75 25.88,47.75 R8.1
N$22
  Top 0.406: U1.10 26.27,37.37 25.28,38.35 21.73,38.35 20.58,39.5 20.16,39.5 R9.1
N$23
  Top 0.406: U2.10 27.35,13.24 26.81,12.7 25.63,12.7 R15.1
N$24
  Top 0.406: U2.4 28.27,19.24 27.7,19.81 27.4,19.81 R14.1
N$27  (via drill 0.6)
  Top 0.406: U6.36 21.45,28.85 22.49,27.81 v22.49,27.18 | R17.2 22.24,14.48 v21.6,13.84
  Bottom 0.406: v22.49,27.18 22.62,27.05 22.62,25.65 23.63,24.64 23.63,14.73 23.12,14.22 21.98,14.22 v21.6,13.84
N$28
  Top 0.406: U2.8 25.66,15.24 25.16,15.75 21.85,15.75 19.44,13.34 18.17,13.34 17.79,12.95 15.97,12.95 R23.1 15.89,13.25 15.89,14.73 15.76,14.86 R22.1
N$29
  Top 0.406: R21.1 17.28,41.91 18.17,42.8 | 18.17,42.8 18.55,43.18 21.6,43.18 21.85,42.93 23.51,42.93 27.06,39.37 U1.8 | R20.1 17.03,43.94 18.17,42.8
N$32  (via drill 0.6)
  Top 0.406: U6.30 15.83,29.79 v16.27,30.35 | R10.2 23.63,45.34 v22.74,45.09
  Bottom 0.406: v16.27,30.35 16.39,30.23 18.17,30.23 19.19,31.24 19.19,35.56 18.3,36.45 18.3,37.72 18.93,38.35 18.93,40.51 18.3,41.15 18.3,43.81 19.57,45.09 v22.74,45.09
N$33  (via drill 0.6)
  Top 0.406: U6.31 16.62,28.3 v17.16,28.83 | v19.57,42.04 19.95,42.04 20.33,41.66 R11.2
  Bottom 0.406: v17.16,28.83 17.54,29.34 18.81,29.34 20.08,30.61 20.08,35.94 19.19,36.83 19.19,37.34 19.82,37.97 19.82,40.89 19.44,41.27 19.44,41.91 v19.57,42.04
N$35  (via drill 0.6)
  Top 0.406: U6.37 18.73,29.64 18.43,29.34 18.43,27.81 v18.04,27.43 | R14.2 25.03,19.94 24.9,20.07 21.35,20.07 20.58,19.3 20.33,19.3 19.57,18.54 v18.93,18.54
  Bottom 0.406: v18.93,18.54 19.7,18.67 20.08,19.05 20.08,21.97 19.44,22.61 19.44,27.05 19.06,27.43 v18.04,27.43
N$36  (via drill 0.6)
  Top 0.406: U6.38 21.12,30.45 23.63,27.94 v23.89,27.94 | R15.2 23.12,11.94 v21.98,11.05
  Bottom 0.406: v21.98,11.05 22.49,10.92 23.89,10.92 25.41,12.45 25.41,26.42 v23.89,27.94
N$37  (via drill 0.6)
  Top 0.406: U6.27 13.45,26.95 v13.09,27.3 | v11.57,22.99 11.57,21.84 12.71,20.7 12.71,19.56 14.4,17.87 R16.2
  Bottom 0.406: v13.09,27.3 11.57,25.78 v11.57,22.99
N$39  (via drill 0.6)
  Top 0.406: QEI1.P$2 5.34,45.21 6.11,45.97 9.28,45.97 9.79,45.47 10.81,45.47 12.96,47.62 15.38,47.62 v16.27,46.48 | U6.2 17.43,38.46 16.9,38.99 16.9,39.37 v16.77,39.5
  Bottom 0.406: 16.14,46.35 v16.27,46.48 16.52,46.23 16.01,45.72 16.01,41.91 16.39,41.53 16.39,39.88 v16.77,39.5
N$40  (via drill 0.6)
  Top 0.406: v14.62,46.35 14.49,46.74 13.35,46.74 11.31,44.7 7.12,44.7 6.23,43.81 3.95,43.81 v3.82,43.94 | U6.3 16.65,36.88 16.65,37.97 16.39,38.23 15.76,38.23 v15.38,38.61
  Bottom 0.406: v14.62,46.35 15,46.23 15,41.53 15.5,41.02 15.5,38.86 v15.38,38.61 | v3.82,43.94 3.82,43.81 3.57,43.56 3.57,41.27 4.71,40.13 5.22,40.13 QEI1.P$4
N$43
  Top 0.406: U2.7 26.06,16.24 25.66,16.64 21.47,16.64 19.7,14.86 R26.1
N$44
  Top 0.406: U6.25 11.85,24.49 12.71,23.62 12.71,21.97 13.6,21.08 13.6,19.94 14.87,18.67 17.28,18.67 18.3,19.68 19.44,19.68 19.95,20.19 20.2,20.19 20.97,20.95 24.39,20.95 24.65,21.21 26.81,21.21 27.44,21.84 27.44,22.35 | R28.2 31.04,26.42 30.49,26.42 30.24,26.16 30.24,23.5 29.98,23.24 28.08,23.24 27.44,22.61 27.44,22.35 | R29.1 27.32,22.48 27.44,22.35
N$45  (via drill 0.6)
  Top 0.406: D1.A v60.59,13.21 | LED2.4 67.82,13.96 68.08,14.22 68.08,14.48 67.57,14.99 v67.32,14.99
  Bottom 0.406: v60.59,13.21 60.72,13.46 61.22,13.97 63.51,13.97 63.76,14.22 66.56,14.22 v67.32,14.99
N$46
  Top 0.406: R27.1 21.05,44.2 21.85,44.2 22.24,43.81 23.89,43.81 27.33,40.37 U1.7
N$47
  Top 0.406: 12.46,38.86 C1.1 11.95,38.99 12.71,38.23 13.22,38.23 13.45,38 U6.7
N$49  (via drill 0.6)  (2 unrouted)
  Top 0.305: U1.13 35.4,34.37 36.08,35.05 v36.08,36.32 | 36.08,37.08 35.39,39.23 | 35.39,39.23 35.32,39.45 | 35.32,39.45 33.79,44.2 U1.3 | U1.23 35.39,39.23 | U2.13 35.06,10.41 v36.08,12.19 33.54,20.07 U2.3 | Q1.6 51.37,25.73 Q1.9 | U1.NC/VCC@1 U1.NC/VCC 35.24,39.37 35.32,39.45 | 46.75,15.24 U2.23 U2.NC/VCC@1 | LED3.1 48.52,27.43 49.03,26.92 49.03,26.38 | Q1.5 51.66,26.38 51.7,26.42
  Top 0.406: Q1.5 49.03,26.38 34.6,26.38 34.43,26.54 R28.1 | U2.23 37.09,15.24 v36.08,14.22
  Top 0.61: C5.1 52.46,35.31 v53.35,36.32 | C6.1 52.33,19.81 53.48,20.95
  Top 1.676: v53.1,11.68 53.86,12.45 C3.+ 53.86,16 54.62,17.02 54.62,19.81 53.48,20.95 51.89,22.55 arc-45 51.7,23 Q1.9 51.7,26.42 51.7,27.55 arc-45 51.89,28 54.62,30.73 54.62,35.05 v53.35,36.32 53.86,36.83 C4.+ | v36.08,12.19 36.08,12.45 | v36.08,36.32 36.08,37.08 | U2.NC/VCC 35.12,15.18 v36.08,14.22 | 35.39,39.23 35.39,39.04 v36.08,38.35
  Bottom 1.676: v53.1,11.68 46.75,11.68 44.71,9.65 38.62,9.65 v36.08,12.19 v36.08,14.22 | v53.35,36.32 38.11,36.32 | 38.11,36.32 v36.08,38.35 v36.08,36.32 38.11,36.32
N$50  (via drill 0.6)
  Top 0.406: LED1.2 67.57,40.65 67.83,40.39 67.83,40.13 v67.32,39.62 | D4.A v60.59,41.15
  Bottom 0.406: v67.32,39.62 65.29,41.15 v60.59,41.15
N$52  (via drill 0.6)
  Top 0.406: LED2.2 68.33,12.96 v68.34,12.95 | D2.A 60.97,14.22 60.97,14.99 61.48,15.49 v61.61,15.49
  Bottom 0.406: v68.34,12.95 68.34,15.49 67.83,16 66.81,16 66.3,15.49 v61.61,15.49
N$53  (via drill 0.6)
  Top 0.406: R25.2 59.07,11.05 v59.19,10.92 | LED2.1 v64.26,12.96 64.02,13.21 D1.C
  Bottom 0.406: v64.26,12.96 62.25,12.96 61.22,11.94 60.21,11.94 v59.19,10.92
PWM1H2  (via drill 0.6)
  Top 0.406: U6.10 11.03,35.41 v10.55,35.05 | v10.17,21.72 10.42,21.34 10.81,21.34 11.82,20.32 11.82,19.18 13.22,17.78 13.22,16.64 13.73,16.13 15.89,16.13 16.94,15.07 R26.2
  Bottom 0.406: 10.42,34.8 v10.55,35.05 10.3,34.67 10.3,33.15 11.31,32.13 11.31,30.35 10.55,29.59 10.55,24.51 10.17,24.13 v10.17,21.72
RA0  (via drill 0.6)
  Top 0.406: R8.2 21.6,47.88 v20.97,46.86 | U6.19 10.25,29.64 10.68,29.21 12.96,29.21 v13.09,29.08
  Bottom 0.406: v13.09,29.08 13.09,32.38 13.6,32.89 13.6,35.43 14.87,36.7 15.76,36.7 18.04,38.99 18.04,40.01 17.28,40.77 17.28,41.91 17.03,42.16 17.03,45.34 18.55,46.86 v20.97,46.86
RA1  (via drill 0.6)
  Top 0.406: U6.20 9.76,28.85 10.68,27.94 11.69,27.94 v11.69,28.07 | 18.68,39.66 R9.2 18.3,39.41 18.3,39.88 17.54,40.64 14.74,40.64 14.49,40.39 v14.36,40.39
  Bottom 0.406: v11.69,28.07 11.95,28.19 11.95,29.72 12.2,30.1 12.2,32.77 12.71,33.27 12.71,35.69 12.84,35.81 12.84,38.73 v14.36,40.39
RB2  (via drill 0.6)
  Top 0.406: C14.1 6.61,24.89 6.87,25.15 6.87,25.53 v7.25,25.91 8.65,25.91 9.66,24.89 10.17,24.89 | D6.A 9.66,24.38 10.17,24.89 | v8.01,43.18 9.03,43.18 9.92,42.29 11.57,42.29 13.22,43.94 R20.2 | 10.17,24.89 10.17,25.55 U6.23
  Bottom 0.406: v7.25,25.91 8.01,26.67 8.01,31.37 7.63,31.75 7.63,40.13 8.01,40.64 v8.01,43.18
RB3
  Top 0.406: 8.77,20.95 7.5,20.95 6.61,21.84 C13.1 | 8.77,20.95 9.28,20.45 10.42,20.45 10.93,19.94 10.93,18.8 12.33,17.4 12.33,16.26 12.71,15.88 12.71,15.11 12.96,14.86 R22.2 | 8.77,20.95 8.77,22.23 9.35,22.8 D5.A 9.92,23.11 11.03,24.23 U6.24
RB6  (via drill 0.6)
  Top 0.406: U6.4 15.83,35.87 16.14,35.56 17.03,35.56 17.54,35.05 v17.92,35.05
  Bottom 0.406: v17.92,35.05 16.52,35.81 15.25,35.81 14.49,35.05 14.49,32.64 13.98,32.13 13.98,29.97 14.23,29.72 14.23,26.67 12.84,25.27 12.84,22.48 8.9,18.54 8.9,16.38 QEI2.P$2
RB7  (via drill 0.6)
  Top 0.406: 15,36.83 U6.5 15.02,35.03 v15.76,34.54
  Bottom 0.406: 16.01,34.29 v15.76,34.54 15.76,31.75 15,30.99 15,26.04 13.73,24.77 13.73,22.1 9.79,18.16 9.79,16 6.87,13.08 6.87,9.4 6.11,8.64 5.6,8.64 5.34,8.38 QEI2.P$4
RC8  (via drill 0.6)
  Top 0.406: S1.2 8.77,19.43 8.14,18.8 8.14,16.64 10.04,14.73 10.04,13.34 v10.42,12.95 10.81,12.57 11.19,12.57 11.91,11.98 R1.1 12.04,11.18 12.46,11.18 12.96,10.67 13.73,10.67 U4.1 | U6.32 17.43,24.49 18.04,23.88 18.17,23.88 v18.2,23.85
  Bottom 0.406: v10.42,12.95 10.68,13.21 12.2,13.21 15,16 15,20.07 15.89,20.95 17.92,20.95 18.3,21.34 18.3,23.75 v18.2,23.85
RC9  (via drill 0.6)
  Top 0.406: v17.16,11.68 16.77,11.56 15.76,11.56 | U6.35 20.99,28.04 21.35,27.69 21.35,26.67 22.11,25.91 23.89,25.91 v24.01,26.04 | S1.1 9.41,17.91 9.41,16.64 10.93,15.11 10.93,14.1 13.47,11.56 15.76,11.56 | R2.1 U4.2 14.87,9.27 15.25,9.65 15.25,11.05 15.76,11.56
  Bottom 0.406: v17.16,11.68 17.41,11.43 20.33,11.43 21.6,12.7 23.38,12.7 24.52,13.84 24.52,25.4 v24.01,26.04
U2ENA
  Top 0.406: U2.5 28,18.24 27.57,18.67 26.17,18.67 25.03,17.53 24.39,17.53 | R18.2 23.72,18.71 24.39,18.03 24.39,17.53 | 24.39,17.53 21.09,17.53 19.7,16.13 17.37,16.13 R16.1
U2ENB
  Top 0.406: U2.9 26.95,14.24 26.3,13.59 25.16,13.59 | 20.71,12.06 R19.2 20.67,12.19 21.73,12.19 22.74,13.21 24.78,13.21 25.16,13.59 | 25.16,13.59 25.12,13.59 R17.1
VBAT  (via drill 0.6)
  Top 0.305: Q1.1 55.34,24.43 56.4,23.37 59.7,23.37 60.97,24.64 60.97,25.65 J3.2 J3.1 | Q1.2 55.58,25.07 55.64,25.02 | Q1.3 55.57,25.73 55.64,25.65
  Top 0.406: U2.12 28.14,11.24 27.57,10.67 v27.57,10.16 | U1.12 28.27,35.37 27.95,35.05 27.95,31.62 28.59,30.99 29.47,30.99 29.98,30.48 v29.98,29.97
  Bottom 0.406: 60.97,28.7 J3.1 59.14,30.48 48.52,30.48 48.02,29.97 v29.98,29.97 30.24,28.96 30.24,12.95 v27.57,10.16
  pour Top: 54.62,25.78 56.14,25.78 56.14,25.15 57.16,24.13 58.68,24.13 59.7,25.15 59.7,29.72 59.95,29.97 62.49,29.97 62.75,29.72 62.75,23.37 61.22,21.84 55.64,21.84 54.62,22.86
VCC  (via drill 0.6)
  Top 0.406: U6.17 v10.17,31.24 | 14.23,31.75 U6.28 14.23,24.38 13.6,23.75 13.6,23.24 14.02,22.82 C8.1 14.02,21.93 14.74,21.21 14.74,20.32 15.25,19.81 v16.65,19.81 | JP3.2 5.09,35.05 6.87,36.7 8.65,36.7 9.28,37.34 9.28,37.85 8.9,38.1 | 9.03,7.24 v8.65,7.11 | 14.23,31.75 15,32.51 18.17,32.51 18.81,32 19.57,32 19.59,32.03 U6.40 22.77,32.03 v23,32.26 24.39,32.26 24.52,32.13 C9.1 | R7.2 8.9,38.1 | 8.9,38.1 9.28,38.35 9.28,40.01 v9.54,40.26 9.41,40.39 9.41,41.4 9.03,41.78 C10.1 | D6.C 7.63,24.13 7.38,23.88 | 7.38,23.88 7.5,23.24 7.63,23.11 | 7.63,23.11 D5.C | 7.63,23.11 7.38,23.11 v7,23.5 7.38,23.88 | v10.04,46.74 11.82,48.51 16.01,48.51 16.65,47.88 R12.1 | 14.23,31.75 14.11,31.75 | R3.2 8.77,7.24 | R2.2 9.03,9.27 8.9,9.14 | R1.2 9.03,11.3 8.9,11.18 | R5.2 22.74,7.75 23.12,8.13 26.3,8.13 | 26.3,8.13 v26.81,7.62 | R4.2 26.05,6.86 v26.81,7.62 | C2.1 27.32,6.48 26.93,6.86 26.93,7.49 v26.81,7.62 | 26.3,8.13 26.3,8.72 R6.2 25.63,10.33 25.41,10.67 23.38,10.67 22.62,9.91 20.46,9.91 19.82,10.54 U4.8 18.85,10.76 R19.1 | R18.1 21.6,18.8 21.22,18.41 20.71,18.41 19.31,17.02 18.04,17.02 v17.79,17.4 | R13.1 22.24,39.62 v21.85,40.01
  Top 0.61: 27.61,6.35 C2.1
  Top 1.016: v10.17,31.24 13.6,31.24 14.11,31.75 | v6.87,19.56 6.87,16.26 8.9,14.22 8.9,11.18 8.9,9.14 8.9,7.37 v8.65,7.11 8.77,7.24
  Bottom 0.406: 9.54,6.35 9.66,6.22 | 7.88,23.37 v7,23.5 | 9.54,40.64 9.66,40.39 v9.54,40.26 | v23,32.26 23,35.43 23.63,36.07 23.63,37.85 21.85,39.62 v21.85,40.01 | v16.65,19.81 16.65,17.91 17.03,17.53 17.66,17.53 v17.79,17.4
  Bottom 0.61: P9.3 P9.4 | 8.9,39.37 9.54,40.64 9.28,40.89 9.28,46.1 v10.04,46.74
  Bottom 0.813: 9.66,6.22 6.11,6.22 P9.4 | 9.54,6.35 9.54,6.48 v8.65,7.11
  Bottom 1.016: 9.66,6.22 25.03,6.22 v26.81,7.62 | 8.9,39.37 8.9,32.51 10.17,31.5 v10.17,31.24 9.28,30.35 9.28,25.02 7.88,23.62 7.88,23.37 7.88,20.07 7.38,19.56 v6.87,19.56
VCC/2  (1 unrouted)
  Top 0.406: QEI2.P$1 5.34,15.33 C12.1
  Top 0.61: P9.8 7.76,6.1 3.82,6.1 3.57,6.35 3.57,14.73 4.2,15.37 QEI2.P$1 | 5.35,47.62 5.6,47.62 5.85,47.37 C11.1
  Bottom 0.61: P9.7 P9.8 | 3.16,47.34 2.8,46.99 2.04,46.23 2.04,40.64 3.06,39.62 3.06,17.02 4.71,15.37 QEI2.P$1
  Bottom 0.813: QEI1.P$1 3.44,47.62 2.8,46.99

### Text on the board
Bottom: DMCC Mk.7 - http://exadler.com
tPlace: QEI1 | Motor 1 | Battery / 24V Max | Dual Motor Control Cape | (DMCC) Mk.7 | Status | Power / LED | QEI2 | Motor 2 | Top / Component Layer
bPlace: +5V | A | GND | B | +5V | A | GND | B